# EAGLE design V-00778-00 (EAGLE 7.2.0)
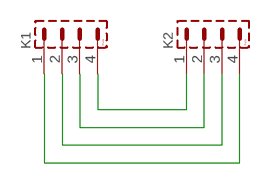
[diagram p0: schematic, sheet 1]

## Parts
K1  PSH02-04P  [PSH02-04P]
K2  PSH02-04P  [PSH02-04P]

## Nets
N$1: K1.4 K2.1
N$2: K1.3 K2.2
N$3: K1.2 K2.3
N$4: K1.1 K2.4

## Library data of the parts
K1 K2 = #PaJa_konektory:PSH02-04: Konektory se zamkem - vidlice - 4pin

## Board
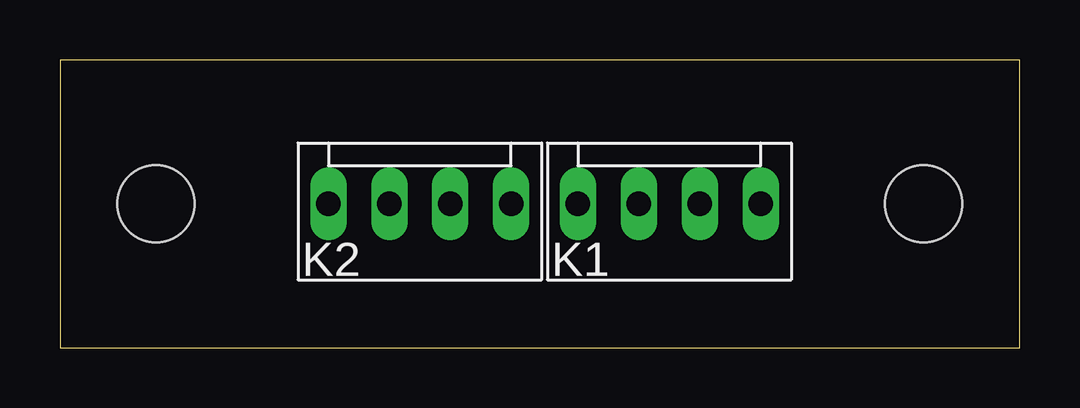
[diagram p1: board, top side]
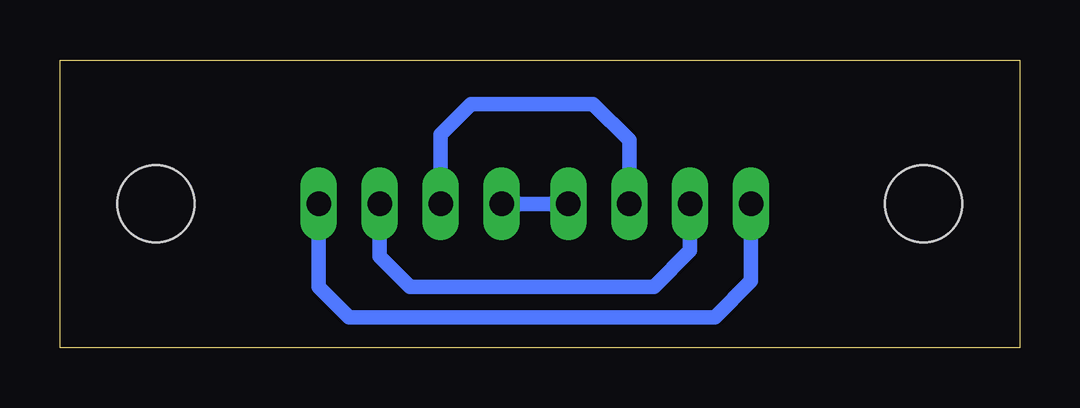
[diagram p2: board, bottom side, seen from below]

Size 40 x 12 mm. Coordinates in mm from the lower left corner, seen from the top.
Outline: 0,0 40,0 40,12 0,12 0,0
Copper layers (1*16): Top 0.035mm / dielectric 1.5mm / Bottom 0.035mm
Design rules "default": minimum track width 10mil, minimum drill 24mil, track to track 8mil, track to pad 8mil, pad to pad 8mil, via to via 8mil, smd to smd 8mil, copper to edge 40mil, drill to drill 8mil, minimum pad ring 10mil, minimum via ring 8mil, stop-mask expansion 4mil, vias tented up to drill 0mil, thermal gap 10mil
Holes 3.2 mm at 36,6 4,6

### Footprints (pad centres in the part's own frame; a part is rotated, then mirrored left to right if it is on the bottom)
PSH02-04P = drill 1.016 pad 1.422 long: 1 -3.81,0; 2 -1.27,0; 3 1.27,0; 4 3.81,0

### Placement (x,y rotation side)
K1  25.4,6 0 top
K2  15,6 0 top

### Tracks (layer width: path | path; a pad name or v marks a point on that pad's centre or on a via)
N$1
  Bottom 0.61: K2.1 11.19,2.78 12.7,1.27 27.94,1.27 29.21,2.54 K1.4
N$2
  Bottom 0.61: K2.2 13.73,4.05 15.24,2.54 25.4,2.54 26.67,3.81 K1.3
N$3
  Bottom 0.61: K2.3 16.27,8.65 17.78,10.16 22.86,10.16 24.13,8.89 K1.2
N$4
  Bottom 0.61: K2.4 K1.1